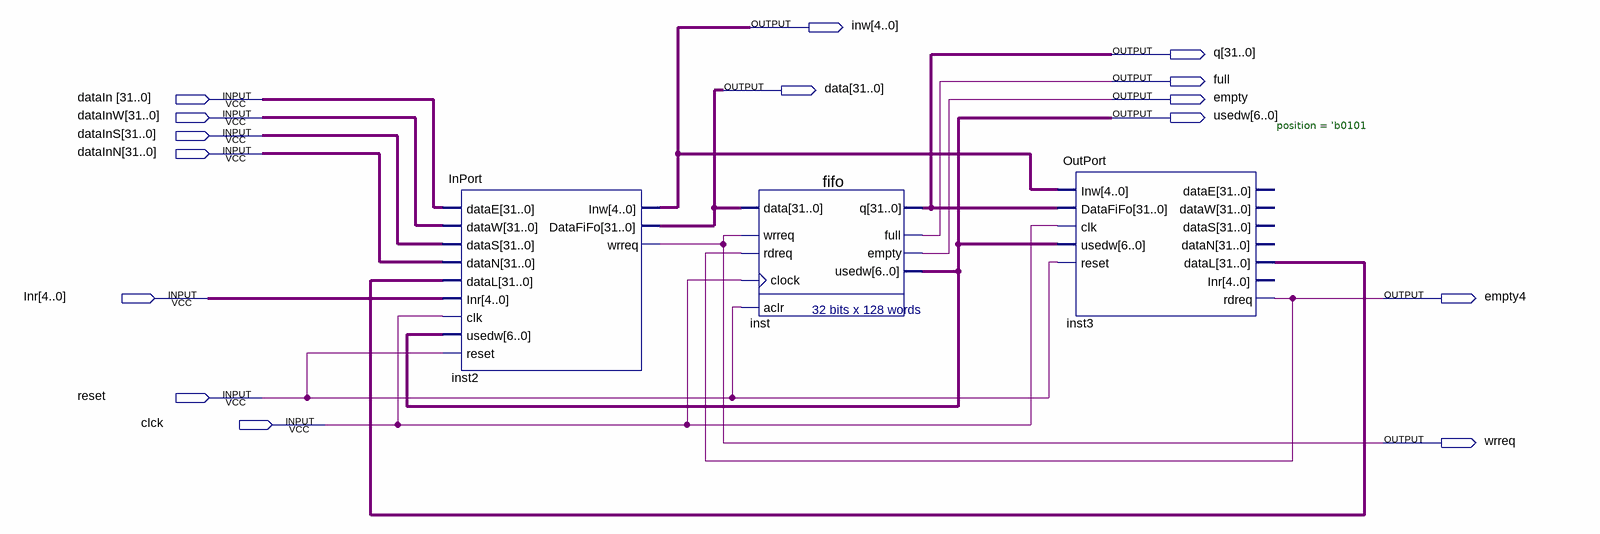
[diagram p0: schematic sheet]
// Quartus schematic NoCSimp3.bdf as structural Verilog: 3 symbols, 15 pins
module NoCSimp3 (
  input  [31:0] dataIn,
  input  [31:0] dataInW,
  input  [31:0] dataInS,
  input  [31:0] dataInN,
  input  [4:0] Inr,
  input  reset,
  input  clck,
  output [4:0] inw,
  output [31:0] q,
  output full,
  output [31:0] data,
  output empty,
  output [6:0] usedw,
  output empty4,
  output wrreq
);

  wire [31:0] inst3_datal;

  InPort inst2 (
    .dataE(dataIn), .dataW(dataInW), .dataS(dataInS), .dataN(dataInN), .dataL(inst3_datal), .Inr(Inr),
    .clk(clck), .usedw(usedw), .reset(reset), .Inw(inw), .DataFiFo(data), .wrreq(wrreq));
  fifo inst (
    .data(data), .wrreq(wrreq), .rdreq(empty4), .clock(clck), .aclr(reset), .q(q), .full(full),
    .empty(empty), .usedw(usedw));
  OutPort #(.position('b0101)) inst3 (
    .Inw(inw), .DataFiFo(q), .clk(clck), .usedw(usedw), .reset(reset), .dataL(inst3_datal), .rdreq(empty4));  // open: dataE, dataW, dataS, dataN, Inr
endmodule
